# Altium schematic sheet Sensors.SchDoc: Sensors
size OrCAD B; SheetNumber: 24; SheetTotal: 32
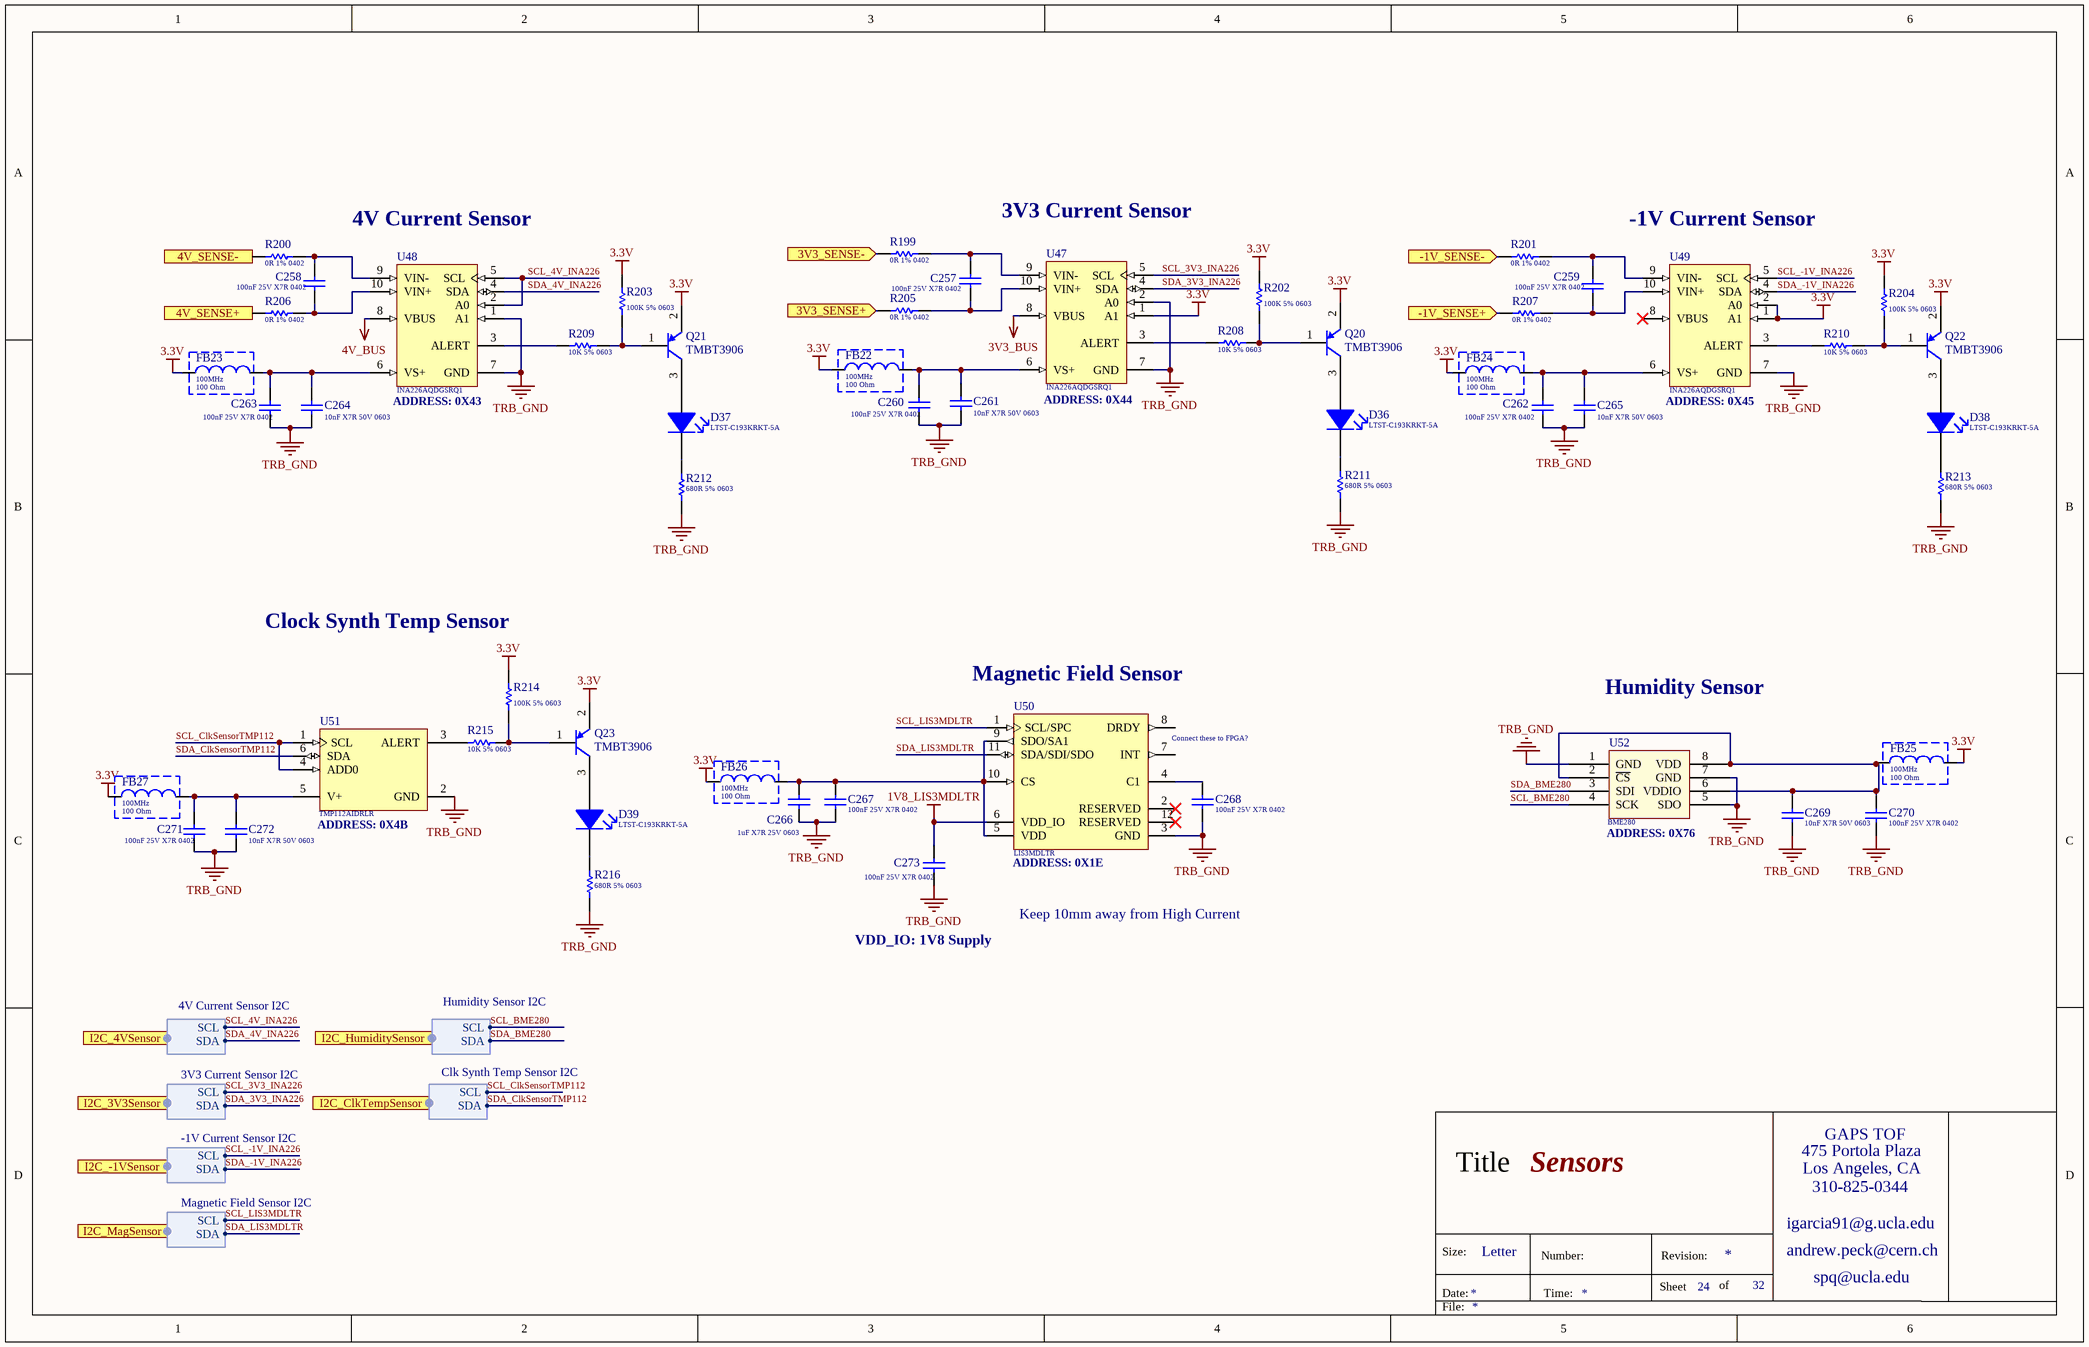
[diagram p0: Sensors.SchDoc]

## Parts
C257  Capacitance: 100nF 25V X7R 0402  [Cap_Taiyo_Yuden_TMK105B7104KV-FR_100nF]  (hidden comment: Cap_Taiyo_Yuden_TMK105B7104KV-FR_100nF)
C258  Capacitance: 100nF 25V X7R 0402  [Cap_Taiyo_Yuden_TMK105B7104KV-FR_100nF]  (hidden comment: Cap_Taiyo_Yuden_TMK105B7104KV-FR_100nF)
C259  Capacitance: 100nF 25V X7R 0402  [Cap_Taiyo_Yuden_TMK105B7104KV-FR_100nF]  (hidden comment: Cap_Taiyo_Yuden_TMK105B7104KV-FR_100nF)
C260  Capacitance: 100nF 25V X7R 0402  [Cap_Taiyo_Yuden_TMK105B7104KV-FR_100nF]  (hidden comment: Cap_Taiyo_Yuden_TMK105B7104KV-FR_100nF)
C261  Capacitance: 10nF X7R 50V 0603  [Kemet_C0603_0]  (hidden comment: Cap_Kemet_C0603C103J5RACTU_eec)
C262  Capacitance: 100nF 25V X7R 0402  [Cap_Taiyo_Yuden_TMK105B7104KV-FR_100nF]  (hidden comment: Cap_Taiyo_Yuden_TMK105B7104KV-FR_100nF)
C263  Capacitance: 100nF 25V X7R 0402  [Cap_Taiyo_Yuden_TMK105B7104KV-FR_100nF]  (hidden comment: Cap_Taiyo_Yuden_TMK105B7104KV-FR_100nF)
C264  Capacitance: 10nF X7R 50V 0603  [Kemet_C0603_0]  (hidden comment: Cap_Kemet_C0603C103J5RACTU_eec)
C265  Capacitance: 10nF X7R 50V 0603  [Kemet_C0603_0]  (hidden comment: Cap_Kemet_C0603C103J5RACTU_eec)
C266  Capacitance: 1uF X7R 25V 0603  [Cap_Murata_GCJ188R71E105KA01J_1uF]  (hidden comment: Cap_Murata_GCJ188R71E105KA01J_1uF)
C267  Capacitance: 100nF 25V X7R 0402  [Cap_Taiyo_Yuden_TMK105B7104KV-FR_100nF]  (hidden comment: Cap_Taiyo_Yuden_TMK105B7104KV-FR_100nF)
C268  Capacitance: 100nF 25V X7R 0402  [Cap_Taiyo_Yuden_TMK105B7104KV-FR_100nF]  (hidden comment: Cap_Taiyo_Yuden_TMK105B7104KV-FR_100nF)
C269  Capacitance: 10nF X7R 50V 0603  [Kemet_C0603_0]  (hidden comment: Cap_Kemet_C0603C103J5RACTU_eec)
C270  Capacitance: 100nF 25V X7R 0402  [Cap_Taiyo_Yuden_TMK105B7104KV-FR_100nF]  (hidden comment: Cap_Taiyo_Yuden_TMK105B7104KV-FR_100nF)
C271  Capacitance: 100nF 25V X7R 0402  [Cap_Taiyo_Yuden_TMK105B7104KV-FR_100nF]  (hidden comment: Cap_Taiyo_Yuden_TMK105B7104KV-FR_100nF)
C272  Capacitance: 10nF X7R 50V 0603  [Kemet_C0603_0]  (hidden comment: Cap_Kemet_C0603C103J5RACTU_eec)
C273  Capacitance: 100nF 25V X7R 0402  [Cap_Taiyo_Yuden_TMK105B7104KV-FR_100nF]  (hidden comment: Cap_Taiyo_Yuden_TMK105B7104KV-FR_100nF)
D36  LTST-C193KRKT-5A  [Led_Lite-On_LTST-C193KGKT-5A_Red]
D37  LTST-C193KRKT-5A  [Led_Lite-On_LTST-C193KGKT-5A_Red]
D38  LTST-C193KRKT-5A  [Led_Lite-On_LTST-C193KGKT-5A_Red]
D39  LTST-C193KRKT-5A  [Led_Lite-On_LTST-C193KGKT-5A_Red]
FB22  Measuring Frequency: 100MHz  Impedance: 100 Ohm  [FB_Wurth_Electronics_742792731_100Ohms]  (hidden comment: 742792731)
FB23  Measuring Frequency: 100MHz  Impedance: 100 Ohm  [FB_Wurth_Electronics_742792731_100Ohms]  (hidden comment: 742792731)
FB24  Measuring Frequency: 100MHz  Impedance: 100 Ohm  [FB_Wurth_Electronics_742792731_100Ohms]  (hidden comment: 742792731)
FB25  Measuring Frequency: 100MHz  Impedance: 100 Ohm  [FB_Wurth_Electronics_742792731_100Ohms]  (hidden comment: 742792731)
FB26  Measuring Frequency: 100MHz  Impedance: 100 Ohm  [FB_Wurth_Electronics_742792731_100Ohms]  (hidden comment: 742792731)
FB27  Measuring Frequency: 100MHz  Impedance: 100 Ohm  [FB_Wurth_Electronics_742792731_100Ohms]  (hidden comment: 742792731)
Q20  Series: TMBT3906  [BJT_PNP_Toshiba_TMBT3906]  (hidden comment: BJT_PNP_Toshiba_TMBT3906)
Q21  Series: TMBT3906  [BJT_PNP_Toshiba_TMBT3906]  (hidden comment: BJT_PNP_Toshiba_TMBT3906)
Q22  Series: TMBT3906  [BJT_PNP_Toshiba_TMBT3906]  (hidden comment: BJT_PNP_Toshiba_TMBT3906)
Q23  Series: TMBT3906  [BJT_PNP_Toshiba_TMBT3906]  (hidden comment: BJT_PNP_Toshiba_TMBT3906)
R199  Resistance: 0R 1% 0402  [Res_Vishay_CRCW04020000Z0EDC_0_Ohm]  (hidden comment: Res_Vishay_CRCW04020000Z0EDC_0_Ohm)
R200  Resistance: 0R 1% 0402  [Res_Vishay_CRCW04020000Z0EDC_0_Ohm]  (hidden comment: Res_Vishay_CRCW04020000Z0EDC_0_Ohm)
R201  Resistance: 0R 1% 0402  [Res_Vishay_CRCW04020000Z0EDC_0_Ohm]  (hidden comment: Res_Vishay_CRCW04020000Z0EDC_0_Ohm)
R202  100K 5% 0603  [RESC0603(1608)_N]
R203  100K 5% 0603  [RESC0603(1608)_N]
R204  100K 5% 0603  [RESC0603(1608)_N]
R205  Resistance: 0R 1% 0402  [Res_Vishay_CRCW04020000Z0EDC_0_Ohm]  (hidden comment: Res_Vishay_CRCW04020000Z0EDC_0_Ohm)
R206  Resistance: 0R 1% 0402  [Res_Vishay_CRCW04020000Z0EDC_0_Ohm]  (hidden comment: Res_Vishay_CRCW04020000Z0EDC_0_Ohm)
R207  Resistance: 0R 1% 0402  [Res_Vishay_CRCW04020000Z0EDC_0_Ohm]  (hidden comment: Res_Vishay_CRCW04020000Z0EDC_0_Ohm)
R208  10K 5% 0603  [RESC0603(1608)_L]
R209  10K 5% 0603  [RESC0603(1608)_L]
R210  10K 5% 0603  [RESC0603(1608)_L]
R211  680R 5% 0603  [RESC0603(1608)_L]
R212  680R 5% 0603  [RESC0603(1608)_L]
R213  680R 5% 0603  [RESC0603(1608)_L]
R214  100K 5% 0603  [RESC0603(1608)_N]
R215  10K 5% 0603  [RESC0603(1608)_L]
R216  680R 5% 0603  [RESC0603(1608)_L]
U47  INA226AQDGSRQ1  [INA226AQDGSRQ1]
U48  INA226AQDGSRQ1  [INA226AQDGSRQ1]
U49  INA226AQDGSRQ1  [INA226AQDGSRQ1]
U50  LIS3MDLTR  [LIS3MDLTR]
U51  TMP112AIDRLR  [TMP112AIDRLR]
U52  BME280  [BME280]

## Ports
3V3_SENSE+ (in), 3V3_SENSE- (in), 4V_SENSE+ (in), 4V_SENSE- (in), -1V_SENSE+ (in), -1V_SENSE- (in), I2C_3V3Sensor (harness 3V3 Current Sensor I2C), I2C_4VSensor (harness 4V Current Sensor I2C), I2C_-1VSensor (harness -1V Current Sensor I2C), I2C_ClkTempSensor (harness Clk Synth Temp Sensor I2C), I2C_HumiditySensor (harness Humidity Sensor I2C), I2C_MagSensor (harness Magnetic Field Sensor I2C)

## Harnesses
4V Current Sensor I2C: SCL, SDA
3V3 Current Sensor I2C: SCL, SDA
-1V Current Sensor I2C: SCL, SDA
Magnetic Field Sensor I2C: SCL, SDA
Humidity Sensor I2C: SCL, SDA
Clk Synth Temp Sensor I2C: SCL, SDA

## Nets
1V8_LIS3MDLTR: C273.2 U50.6(VDD_IO)
3.3V: FB22.1 FB23.1 FB24.1 FB25.2 FB26.1 FB27.1 Q20.2(E) Q21.2(E) Q22.2(E) Q23.2(E) R202.2 R203.2 R204.2 R214.2 U47.1(A1) U49.1(A1) U49.2(A0)
3V3_BUS: U47.8(VBUS)
4V_BUS: U48.8(VBUS)
TRB_GND: C260.1 C261.2 C262.1 C263.1 C264.2 C265.2 C266.1 C267.2 C268.2 C269.2 C270.2 C271.1 C272.2 C273.1 R211.1 R212.1 R213.1 R216.1 U47.2(A0) U47.7(GND) U48.1(A1) U48.7(GND) U49.7(GND) U50.3(GND) U51.2(GND) U52.1(GND) U52.5(SDO) U52.7(GND)
3V3_SENSE+: R205.2 ; port 3V3_SENSE+
3V3_SENSE-: R199.2 ; port 3V3_SENSE-
4V_SENSE+: R206.2 ; port 4V_SENSE+
4V_SENSE-: R200.2 ; port 4V_SENSE-
-1V_SENSE+: R207.2 ; port -1V_SENSE+
-1V_SENSE-: R201.2 ; port -1V_SENSE-
SCL_3V3_INA226: U47.5(SCL) ; port I2C_3V3Sensor.SCL
SCL_4V_INA226: U48.2(A0) U48.5(SCL) ; port I2C_4VSensor.SCL
SCL_-1V_INA226: U49.5(SCL) ; port I2C_-1VSensor.SCL
SCL_BME280: U52.4(SCK) ; port I2C_HumiditySensor.SCL
SCL_ClkSensorTMP112: U51.1(SCL) U51.4(ADD0) ; port I2C_ClkTempSensor.SCL
SCL_LIS3MDLTR: U50.1(SCL/SPC) ; port I2C_MagSensor.SCL
SDA_3V3_INA226: U47.4(SDA) ; port I2C_3V3Sensor.SDA
SDA_4V_INA226: U48.4(SDA) ; port I2C_4VSensor.SDA
SDA_-1V_INA226: U49.4(SDA) ; port I2C_-1VSensor.SDA
SDA_BME280: U52.3(SDI) ; port I2C_HumiditySensor.SDA
SDA_ClkSensorTMP112: U51.6(SDA) ; port I2C_ClkTempSensor.SDA
SDA_LIS3MDLTR: U50.11(SDA/SDI/SDO) ; port I2C_MagSensor.SDA
NetC257_1: C257.1 R205.1 U47.10(VIN+)
NetC257_2: C257.2 R199.1 U47.9(VIN-)
NetC258_1: C258.1 R206.1 U48.10(VIN+)
NetC258_2: C258.2 R200.1 U48.9(VIN-)
NetC259_1: C259.1 R207.1 U49.10(VIN+)
NetC259_2: C259.2 R201.1 U49.9(VIN-)
NetC260_2: C260.2 C261.1 FB22.2 U47.6(VS+)
NetC262_2: C262.2 C265.1 FB24.2 U49.6(VS+)
NetC263_2: C263.2 C264.1 FB23.2 U48.6(VS+)
NetC266_2: C266.2 C267.1 FB26.2 U50.5(VDD) U50.9(SDO/SA1) U50.10(CS)
NetC268_1: C268.1 U50.4(C1)
NetC269_1: C269.1 C270.1 FB25.1 U52.2(~{CS}) U52.6(VDDIO) U52.8(VDD)
NetC271_2: C271.2 C272.1 FB27.2 U51.5(V+)
NetD36_1: D36.1(K) R211.2
NetD36_2: D36.2(A) Q20.3(C)
NetD37_1: D37.1(K) R212.2
NetD37_2: D37.2(A) Q21.3(C)
NetD38_1: D38.1(K) R213.2
NetD38_2: D38.2(A) Q22.3(C)
NetD39_1: D39.1(K) R216.2
NetD39_2: D39.2(A) Q23.3(C)
NetQ20_1: Q20.1(B) R202.1 R208.1
NetQ21_1: Q21.1(B) R203.1 R209.1
NetQ22_1: Q22.1(B) R204.1 R210.1
NetQ23_1: Q23.1(B) R214.1 R215.1
NetR208_2: R208.2 U47.3(ALERT)
NetR209_2: R209.2 U48.3(ALERT)
NetR210_2: R210.2 U49.3(ALERT)
NetR215_2: R215.2 U51.3(ALERT)

Not connected (* = marked no-connect by the designer): U49 8(VBUS)*; U50 2(RESERVED)* 7(INT) 8(DRDY) 12(RESERVED)*

## Notes on the sheet
- 3V3 Current Sensor
- 4V Current Sensor
- -1V Current Sensor
- (near U48) ADDRESS: 0X43
- (near U47) ADDRESS: 0X44
- (near U49) ADDRESS: 0X45
- (near R214) Clock Synth Temp Sensor
- (near U50) Magnetic Field Sensor
- Humidity Sensor
- (near U50) Connect these to FPGA?
- (near U51) ADDRESS: 0X4B
- (near U50) ADDRESS: 0X1E
- (near U52) ADDRESS: 0X76
- VDD_IO: 1V8 Supply
- Keep 10mm away from High Current
- 475 Portola Plaza
- GAPS TOF
- Title
- igarcia91@g.ucla.edu
- Los Angeles, CA
- 310-825-0344
- Size:
- Date:
- Letter
- Number:
- Time:
- Sheet
- Revision:
- of
- andrew.peck@cern.ch
- spq@ucla.edu
- File:

## Library data of the parts
C257-C260 C262 C263 C267 C268 C270 C271 C273 = Cap_Taiyo_Yuden_TMK105B7104KV-FR_100nF: CAP CER 100nF 25V X7R 0402; Supplier 1: Mouser; Supplier Part Number 1: 963-TMK105B7104KV-FR
C261 C264 C265 C269 C272 = Cap_Kemet_C0603C103J5RACTU_eec: CAP CER 10nF 50V X7R 0603; Manufacturer: Kemet; Mfg Package Ident: C0603; Part Number: C0603C103J5RACTU; helpURL: https://upverter.com/upn/revision/8a8d0c297e33ac74/; ComponentLink2Description: Datasheet; Temperature: -55°C to +125°C; Package: C0603; Supplier 2: Mouser; Price: 0.0184203126773; Supplier 1: Digi-Key; ComponentLink1URL: https://upverter.com/upn/revision/8a8d0c297e33ac74/; Supplier Part Number 2: 80-C0603C103J5R; Supplier Part Number 1: 399-1092-1-ND; Value: 10nF; ComponentLink1Description: Upverter; ComponentLink2URL: https://content.kemet.com/datasheets/KEM_C1002_X7R_SMD.pdf; RoHS: TRUE; Mouser Part Number: 80-C0603C103J5R; Temperature Range High: +125°C; Digikey Description: CAP CER 10000PF 50V X7R 0603; Digikey Part Number: 399-1092-1-ND; Lead Free: yes; Temperature Range Low: -55°C; Voltage: 50V
C266 = Cap_Murata_GCJ188R71E105KA01J_1uF: CAP CER 1uF 25V X7R 0603; Supplier 1: Mouser; Supplier Part Number 1: 81-GCJ188R71E105KA1J
D36-D39 = Led_Lite-On_LTST-C193KGKT-5A_Red: Standard LEDs - SMD Red 470nm 28mcd 20mA; Supplier 1: Mouser; Supplier Part Number 1: 859-LTSTC193KRKT5A; Series: LTST-C193KRKT-5A
FB22-FB27 = FB_Wurth_Electronics_742792731_100Ohms: FB SMD 100 OHM 25% 1.2A 0402; DC Resistance: 90mOhm; Supplier 1: Mouser; Supplier Part Number 1: 710-742792731
Q20-Q23 = BJT_PNP_Toshiba_TMBT3906: Bipolar Transistors - BJT Transistor for Low Freq. Amplification; Supplier 1: Mouser; Supplier Part Number 1: TMBT3906,LM
R199-R201 R205-R207 = Res_Vishay_CRCW04020000Z0EDC_0_Ohm: 0R 0.062W 1% 0402 (1005 Metric)  SMD; Supplier 1: Mouser; Supplier Part Number 1: 71-CRCW04020000Z0EDC
R202-R204 R214 = CMP-1012-00122-1: 100K 0.1W 5% 0603 (1608 Metric)  SMD; Case-EIA: 0603; Value: 100000.00 Ohm; Case-Metric: 1608; Tolerance: 5 %; Power: 0.1 W; Technology: SMT
R208-R210 R215 = CMP-1012-00098-1: 10K 0.1W 5% 0603 (1608 Metric)  SMD; Case-EIA: 0603; Value: 10000.00 Ohm; Case-Metric: 1608; Technology: SMT; Tolerance: 5 %; Power: 0.1 W
R211-R213 R216 = CMP-1012-00070-1: 680R 0.1W 5% 0603 (1608 Metric)  SMD; Case-EIA: 0603; Value: 680.00 Ohm; Case-Metric: 1608; Tolerance: 5 %; Technology: SMT; Power: 0.1 W
U47-U49 = INA226AQDGSRQ1: Current & Power Monitors & Regulators Automotive, 36-V, Ultra-High Accuracy, Low-/High-Side, I2C Out Current/Power Monitor w/ Alert 10-VSSOP -40 to 125; Supplier 1: Mouser; Supplier Part Number 1: 595-INA226AQDGSRQ1
U50 = LIS3MDLTR: Board Mount Hall Effect / Magnetic Sensors Ultra Lo-Pwr Hi Perf 3-Axis 1.9-3.6V; Supplier 1: Mouser; Supplier Part Number 1: 511-LIS3MDLTR
U51 = TMP112AIDRLR: Board Mount Temperature Sensors Hi-Prec Lo-Pwr Dig Temp Sensor; Supplier 1: Mouser; Supplier Part Number 1: 595-TMP112AIDRLR
U52 = BME280: Board Mount Humidity Sensors; Supplier 1: Mouser; Supplier Part Number 1: 262-BME280